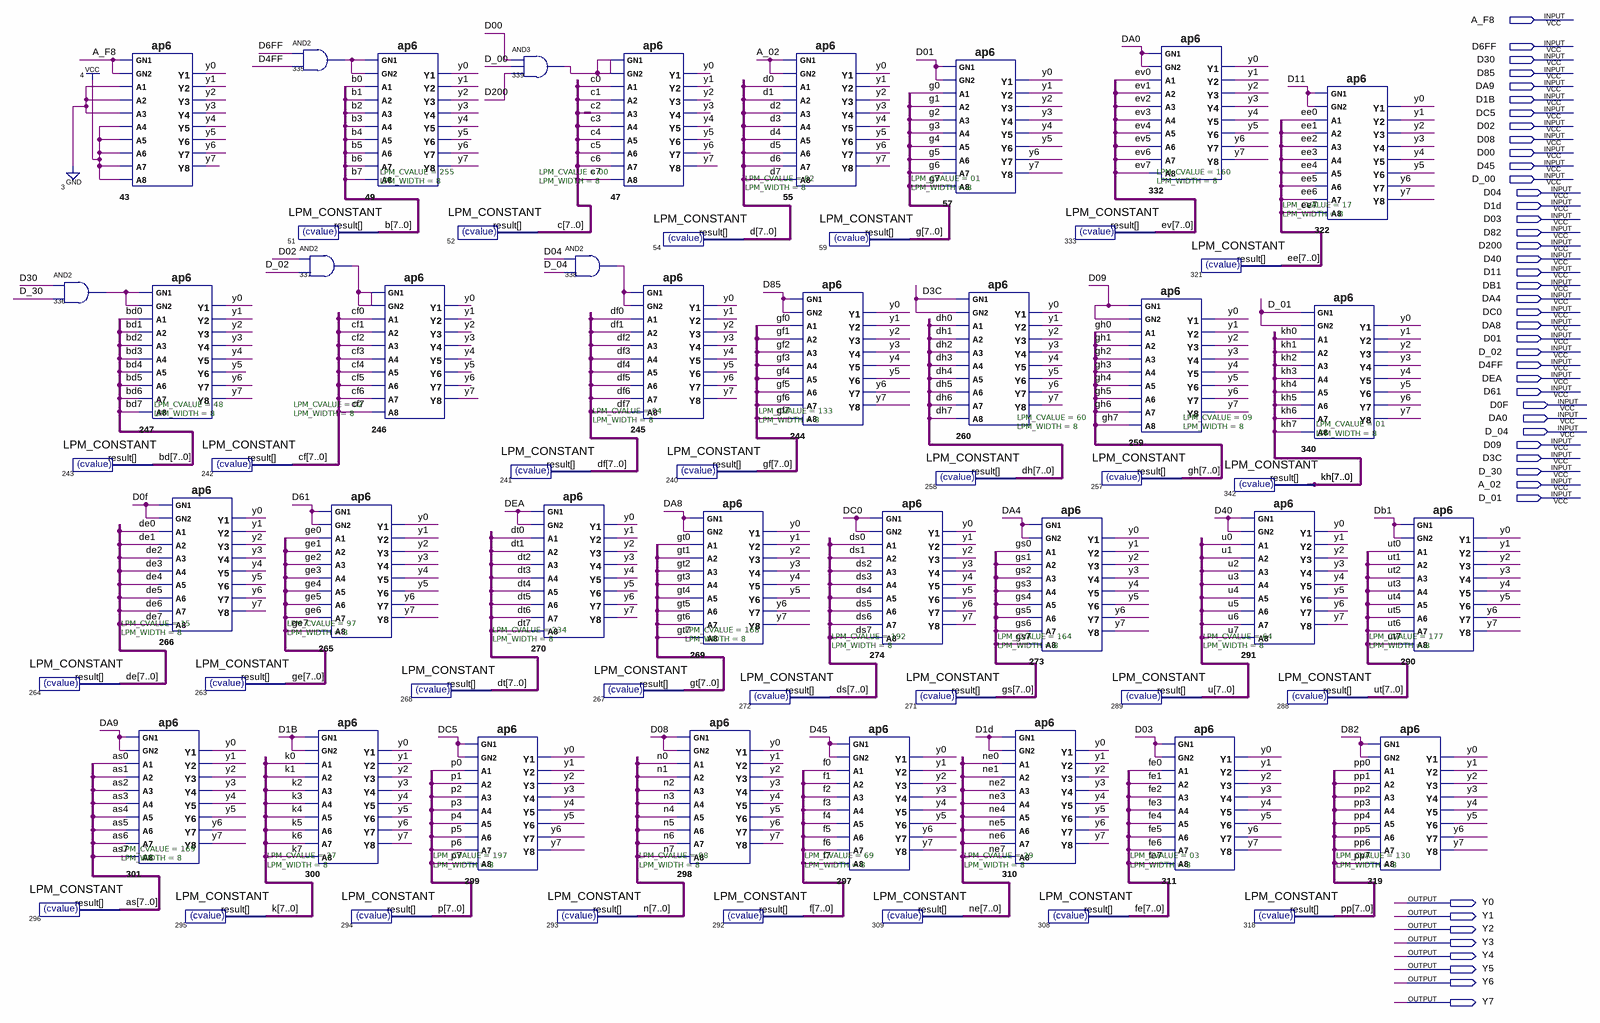
[diagram p0: schematic sheet]
// Quartus schematic romugolev2.bdf as structural Verilog: 64 symbols, 44 pins
module romugolev2 (
  input  A_F8,
  input  D6FF,
  input  D30,
  input  D85,
  input  DA9,
  input  D1B,
  input  DC5,
  input  D02,
  input  D08,
  input  D00,
  input  D45,
  input  D_00,
  input  D04,
  input  D1d,
  input  D03,
  input  D82,
  input  D200,
  input  D40,
  input  D11,
  input  DB1,
  input  DA4,
  input  DC0,
  input  DA8,
  input  D01,
  input  D_02,
  input  D4FF,
  input  DEA,
  input  D61,
  input  D0F,
  input  DA0,
  input  D_04,
  input  D09,
  input  D3C,
  input  D_30,
  input  A_02,
  input  D_01,
  output Y0,
  output Y1,
  output Y2,
  output Y3,
  output Y4,
  output Y5,
  output Y6,
  output Y7
);

  wire n335_out, n336_out, n337_out, n338_out, n339_out;
  wire [7:0] as, b, bd, c, cf, d, de, df, dh, ds, dt, ee, ev, f, fe, g, ge, gf, gh, gs, gt, k, kh, n, ne, p,
       pp, u, ut;

  and u_336 (n336_out, D30, D_30);
  LPM_CONSTANT #(.LPM_CVALUE(15), .LPM_WIDTH(8)) u_264 (.result(de));
  LPM_CONSTANT #(.LPM_CVALUE(169), .LPM_WIDTH(8)) u_296 (.result(as));
  LPM_CONSTANT #(.LPM_CVALUE(48), .LPM_WIDTH(8)) u_243 (.result(bd));
  ap6 u_43 (
    .GN1(A_F8), .GN2(A_F8), .A1(1'b0), .A2(1'b0), .A3(1'b0), .A4(1'b1), .A5(1'b1), .A6(1'b1), .A7(1'b1),
    .A8(1'b1), .Y1(Y0), .Y2(Y1), .Y3(Y2), .Y4(Y3), .Y5(Y4), .Y6(Y5), .Y7(Y6), .Y8(Y7));
  ap6 u_247 (
    .GN1(n336_out), .GN2(n336_out), .A1(bd[0]), .A2(bd[1]), .A3(bd[2]), .A4(bd[3]), .A5(bd[4]), .A6(bd[5]),
    .A7(bd[6]), .A8(bd[7]), .Y1(Y0), .Y2(Y1), .Y3(Y2), .Y4(Y3), .Y5(Y4), .Y6(Y5), .Y7(Y6), .Y8(Y7));
  ap6 u_266 (
    .GN1(D0F), .GN2(D0F), .A1(de[0]), .A2(de[1]), .A3(de[2]), .A4(de[3]), .A5(de[4]), .A6(de[5]), .A7(de[6]),
    .A8(de[7]), .Y1(Y0), .Y2(Y1), .Y3(Y2), .Y4(Y3), .Y5(Y4), .Y6(Y5), .Y7(Y6), .Y8(Y7));
  ap6 u_301 (
    .GN1(DA9), .GN2(DA9), .A1(as[0]), .A2(as[1]), .A3(as[2]), .A4(as[3]), .A5(as[4]), .A6(as[5]), .A7(as[6]),
    .A8(as[7]), .Y1(Y0), .Y2(Y1), .Y3(Y2), .Y4(Y3), .Y5(Y4), .Y6(Y5), .Y7(Y6), .Y8(Y7));
  LPM_CONSTANT #(.LPM_CVALUE(02), .LPM_WIDTH(8)) u_242 (.result(cf));
  LPM_CONSTANT #(.LPM_CVALUE(97), .LPM_WIDTH(8)) u_263 (.result(ge));
  LPM_CONSTANT #(.LPM_CVALUE(27), .LPM_WIDTH(8)) u_295 (.result(k));
  and u_335 (n335_out, D6FF, D4FF);
  LPM_CONSTANT #(.LPM_CVALUE(255), .LPM_WIDTH(8)) u_51 (.result(b));
  and u_337 (n337_out, D02, D_02);
  ap6 u_265 (
    .GN1(D61), .GN2(D61), .A1(ge[0]), .A2(ge[1]), .A3(ge[2]), .A4(ge[3]), .A5(ge[4]), .A6(ge[5]), .A7(ge[6]),
    .A8(ge[7]), .Y1(Y0), .Y2(Y1), .Y3(Y2), .Y4(Y3), .Y5(Y4), .Y6(Y5), .Y7(Y6), .Y8(Y7));
  ap6 u_300 (
    .GN1(D1B), .GN2(D1B), .A1(k[0]), .A2(k[1]), .A3(k[2]), .A4(k[3]), .A5(k[4]), .A6(k[5]), .A7(k[6]),
    .A8(k[7]), .Y1(Y0), .Y2(Y1), .Y3(Y2), .Y4(Y3), .Y5(Y4), .Y6(Y5), .Y7(Y6), .Y8(Y7));
  ap6 u_49 (
    .GN1(n335_out), .GN2(n335_out), .A1(b[0]), .A2(b[1]), .A3(b[2]), .A4(b[3]), .A5(b[4]), .A6(b[5]),
    .A7(b[6]), .A8(b[7]), .Y1(Y0), .Y2(Y1), .Y3(Y2), .Y4(Y3), .Y5(Y4), .Y6(Y5), .Y7(Y6), .Y8(Y7));
  ap6 u_246 (
    .GN1(n337_out), .GN2(n337_out), .A1(cf[0]), .A2(cf[1]), .A3(cf[2]), .A4(cf[3]), .A5(cf[4]), .A6(cf[5]),
    .A7(cf[6]), .A8(cf[7]), .Y1(Y0), .Y2(Y1), .Y3(Y2), .Y4(Y3), .Y5(Y4), .Y6(Y5), .Y7(Y6), .Y8(Y7));
  LPM_CONSTANT #(.LPM_CVALUE(197), .LPM_WIDTH(8)) u_294 (.result(p));
  LPM_CONSTANT #(.LPM_CVALUE(234), .LPM_WIDTH(8)) u_268 (.result(dt));
  LPM_CONSTANT #(.LPM_CVALUE(00), .LPM_WIDTH(8)) u_52 (.result(c));
  ap6 u_299 (
    .GN1(DC5), .GN2(DC5), .A1(p[0]), .A2(p[1]), .A3(p[2]), .A4(p[3]), .A5(p[4]), .A6(p[5]), .A7(p[6]),
    .A8(p[7]), .Y1(Y0), .Y2(Y1), .Y3(Y2), .Y4(Y3), .Y5(Y4), .Y6(Y5), .Y7(Y6), .Y8(Y7));
  and u_339 (n339_out, D00, D_00, D200);
  LPM_CONSTANT #(.LPM_CVALUE(04), .LPM_WIDTH(8)) u_241 (.result(df));
  ap6 u_270 (
    .GN1(DEA), .GN2(DEA), .A1(dt[0]), .A2(dt[1]), .A3(dt[2]), .A4(dt[3]), .A5(dt[4]), .A6(dt[5]), .A7(dt[6]),
    .A8(dt[7]), .Y1(Y0), .Y2(Y1), .Y3(Y2), .Y4(Y3), .Y5(Y4), .Y6(Y5), .Y7(Y6), .Y8(Y7));
  and u_338 (n338_out, D04, D_04);
  LPM_CONSTANT #(.LPM_CVALUE(08), .LPM_WIDTH(8)) u_293 (.result(n));
  ap6 u_47 (
    .GN1(n339_out), .GN2(n339_out), .A1(c[0]), .A2(c[1]), .A3(c[2]), .A4(c[3]), .A5(c[4]), .A6(c[5]),
    .A7(c[6]), .A8(c[7]), .Y1(Y0), .Y2(Y1), .Y3(Y2), .Y4(Y3), .Y5(Y4), .Y6(Y5), .Y7(Y6), .Y8(Y7));
  ap6 u_245 (
    .GN1(n338_out), .GN2(n338_out), .A1(df[0]), .A2(df[1]), .A3(df[2]), .A4(df[3]), .A5(df[4]), .A6(df[5]),
    .A7(df[6]), .A8(df[7]), .Y1(Y0), .Y2(Y1), .Y3(Y2), .Y4(Y3), .Y5(Y4), .Y6(Y5), .Y7(Y6), .Y8(Y7));
  LPM_CONSTANT #(.LPM_CVALUE(168), .LPM_WIDTH(8)) u_267 (.result(gt));
  LPM_CONSTANT #(.LPM_CVALUE(02), .LPM_WIDTH(8)) u_54 (.result(d));
  LPM_CONSTANT #(.LPM_CVALUE(133), .LPM_WIDTH(8)) u_240 (.result(gf));
  ap6 u_269 (
    .GN1(DA8), .GN2(DA8), .A1(gt[0]), .A2(gt[1]), .A3(gt[2]), .A4(gt[3]), .A5(gt[4]), .A6(gt[5]), .A7(gt[6]),
    .A8(gt[7]), .Y1(Y0), .Y2(Y1), .Y3(Y2), .Y4(Y3), .Y5(Y4), .Y6(Y5), .Y7(Y6), .Y8(Y7));
  ap6 u_298 (
    .GN1(D08), .GN2(D08), .A1(n[0]), .A2(n[1]), .A3(n[2]), .A4(n[3]), .A5(n[4]), .A6(n[5]), .A7(n[6]),
    .A8(n[7]), .Y1(Y0), .Y2(Y1), .Y3(Y2), .Y4(Y3), .Y5(Y4), .Y6(Y5), .Y7(Y6), .Y8(Y7));
  LPM_CONSTANT #(.LPM_CVALUE(192), .LPM_WIDTH(8)) u_272 (.result(ds));
  LPM_CONSTANT #(.LPM_CVALUE(69), .LPM_WIDTH(8)) u_292 (.result(f));
  ap6 u_55 (
    .GN1(A_02), .GN2(A_02), .A1(d[0]), .A2(d[1]), .A3(d[2]), .A4(d[3]), .A5(d[4]), .A6(d[5]), .A7(d[6]),
    .A8(d[7]), .Y1(Y0), .Y2(Y1), .Y3(Y2), .Y4(Y3), .Y5(Y4), .Y6(Y5), .Y7(Y6), .Y8(Y7));
  ap6 u_244 (
    .GN1(D85), .GN2(D85), .A1(gf[0]), .A2(gf[1]), .A3(gf[2]), .A4(gf[3]), .A5(gf[4]), .A6(gf[5]), .A7(gf[6]),
    .A8(gf[7]), .Y1(Y0), .Y2(Y1), .Y3(Y2), .Y4(Y3), .Y5(Y4), .Y6(Y5), .Y7(Y6), .Y8(Y7));
  LPM_CONSTANT #(.LPM_CVALUE(01), .LPM_WIDTH(8)) u_59 (.result(g));
  ap6 u_297 (
    .GN1(D45), .GN2(D45), .A1(f[0]), .A2(f[1]), .A3(f[2]), .A4(f[3]), .A5(f[4]), .A6(f[5]), .A7(f[6]),
    .A8(f[7]), .Y1(Y0), .Y2(Y1), .Y3(Y2), .Y4(Y3), .Y5(Y4), .Y6(Y5), .Y7(Y6), .Y8(Y7));
  ap6 u_274 (
    .GN1(DC0), .GN2(DC0), .A1(ds[0]), .A2(ds[1]), .A3(ds[2]), .A4(ds[3]), .A5(ds[4]), .A6(ds[5]), .A7(ds[6]),
    .A8(ds[7]), .Y1(Y0), .Y2(Y1), .Y3(Y2), .Y4(Y3), .Y5(Y4), .Y6(Y5), .Y7(Y6), .Y8(Y7));
  LPM_CONSTANT #(.LPM_CVALUE(164), .LPM_WIDTH(8)) u_271 (.result(gs));
  LPM_CONSTANT #(.LPM_CVALUE(29), .LPM_WIDTH(8)) u_309 (.result(ne));
  ap6 u_57 (
    .GN1(D01), .GN2(D01), .A1(g[0]), .A2(g[1]), .A3(g[2]), .A4(g[3]), .A5(g[4]), .A6(g[5]), .A7(g[6]),
    .A8(g[7]), .Y1(Y0), .Y2(Y1), .Y3(Y2), .Y4(Y3), .Y5(Y4), .Y6(Y5), .Y7(Y6), .Y8(Y7));
  ap6 u_260 (
    .GN1(D3C), .GN2(D3C), .A1(dh[0]), .A2(dh[1]), .A3(dh[2]), .A4(dh[3]), .A5(dh[4]), .A6(dh[5]), .A7(dh[6]),
    .A8(dh[7]), .Y1(Y0), .Y2(Y1), .Y3(Y2), .Y4(Y3), .Y5(Y4), .Y6(Y5), .Y7(Y6), .Y8(Y7));
  LPM_CONSTANT #(.LPM_CVALUE(60), .LPM_WIDTH(8)) u_258 (.result(dh));
  ap6 u_310 (
    .GN1(D1d), .GN2(D1d), .A1(ne[0]), .A2(ne[1]), .A3(ne[2]), .A4(ne[3]), .A5(ne[4]), .A6(ne[5]), .A7(ne[6]),
    .A8(ne[7]), .Y1(Y0), .Y2(Y1), .Y3(Y2), .Y4(Y3), .Y5(Y4), .Y6(Y5), .Y7(Y6), .Y8(Y7));
  LPM_CONSTANT #(.LPM_CVALUE(160), .LPM_WIDTH(8)) u_333 (.result(ev));
  ap6 u_273 (
    .GN1(DA4), .GN2(DA4), .A1(gs[0]), .A2(gs[1]), .A3(gs[2]), .A4(gs[3]), .A5(gs[4]), .A6(gs[5]), .A7(gs[6]),
    .A8(gs[7]), .Y1(Y0), .Y2(Y1), .Y3(Y2), .Y4(Y3), .Y5(Y4), .Y6(Y5), .Y7(Y6), .Y8(Y7));
  LPM_CONSTANT #(.LPM_CVALUE(03), .LPM_WIDTH(8)) u_308 (.result(fe));
  LPM_CONSTANT #(.LPM_CVALUE(09), .LPM_WIDTH(8)) u_257 (.result(gh));
  LPM_CONSTANT #(.LPM_CVALUE(64), .LPM_WIDTH(8)) u_289 (.result(u));
  ap6 u_332 (
    .GN1(DA0), .GN2(DA0), .A1(ev[0]), .A2(ev[1]), .A3(ev[2]), .A4(ev[3]), .A5(ev[4]), .A6(ev[5]), .A7(ev[6]),
    .A8(ev[7]), .Y1(Y0), .Y2(Y1), .Y3(Y2), .Y4(Y3), .Y5(Y4), .Y6(Y5), .Y7(Y6), .Y8(Y7));
  ap6 u_259 (
    .GN1(D09), .GN2(D09), .A1(gh[0]), .A2(gh[1]), .A3(gh[2]), .A4(gh[3]), .A5(gh[4]), .A6(gh[5]), .A7(gh[6]),
    .A8(gh[7]), .Y1(Y0), .Y2(Y1), .Y3(Y2), .Y4(Y3), .Y5(Y4), .Y6(Y5), .Y7(Y6), .Y8(Y7));
  ap6 u_311 (
    .GN1(D03), .GN2(D03), .A1(fe[0]), .A2(fe[1]), .A3(fe[2]), .A4(fe[3]), .A5(fe[4]), .A6(fe[5]), .A7(fe[6]),
    .A8(fe[7]), .Y1(Y0), .Y2(Y1), .Y3(Y2), .Y4(Y3), .Y5(Y4), .Y6(Y5), .Y7(Y6), .Y8(Y7));
  LPM_CONSTANT #(.LPM_CVALUE(17), .LPM_WIDTH(8)) u_321 (.result(ee));
  LPM_CONSTANT #(.LPM_CVALUE(01), .LPM_WIDTH(8)) u_342 (.result(kh));
  ap6 u_291 (
    .GN1(D40), .GN2(D40), .A1(u[0]), .A2(u[1]), .A3(u[2]), .A4(u[3]), .A5(u[4]), .A6(u[5]), .A7(u[6]),
    .A8(u[7]), .Y1(Y0), .Y2(Y1), .Y3(Y2), .Y4(Y3), .Y5(Y4), .Y6(Y5), .Y7(Y6), .Y8(Y7));
  LPM_CONSTANT #(.LPM_CVALUE(177), .LPM_WIDTH(8)) u_288 (.result(ut));
  LPM_CONSTANT #(.LPM_CVALUE(130), .LPM_WIDTH(8)) u_318 (.result(pp));
  ap6 u_322 (
    .GN1(D11), .GN2(D11), .A1(ee[0]), .A2(ee[1]), .A3(ee[2]), .A4(ee[3]), .A5(ee[4]), .A6(ee[5]), .A7(ee[6]),
    .A8(ee[7]), .Y1(Y0), .Y2(Y1), .Y3(Y2), .Y4(Y3), .Y5(Y4), .Y6(Y5), .Y7(Y6), .Y8(Y7));
  ap6 u_340 (
    .GN1(D_01), .GN2(D_01), .A1(kh[0]), .A2(kh[1]), .A3(kh[2]), .A4(kh[3]), .A5(kh[4]), .A6(kh[5]),
    .A7(kh[6]), .A8(kh[7]), .Y1(Y0), .Y2(Y1), .Y3(Y2), .Y4(Y3), .Y5(Y4), .Y6(Y5), .Y7(Y6), .Y8(Y7));
  ap6 u_319 (
    .GN1(D82), .GN2(D82), .A1(pp[0]), .A2(pp[1]), .A3(pp[2]), .A4(pp[3]), .A5(pp[4]), .A6(pp[5]), .A7(pp[6]),
    .A8(pp[7]), .Y1(Y0), .Y2(Y1), .Y3(Y2), .Y4(Y3), .Y5(Y4), .Y6(Y5), .Y7(Y6), .Y8(Y7));
  ap6 u_290 (
    .GN1(DB1), .GN2(DB1), .A1(ut[0]), .A2(ut[1]), .A3(ut[2]), .A4(ut[3]), .A5(ut[4]), .A6(ut[5]), .A7(ut[6]),
    .A8(ut[7]), .Y1(Y0), .Y2(Y1), .Y3(Y2), .Y4(Y3), .Y5(Y4), .Y6(Y5), .Y7(Y6), .Y8(Y7));
endmodule
